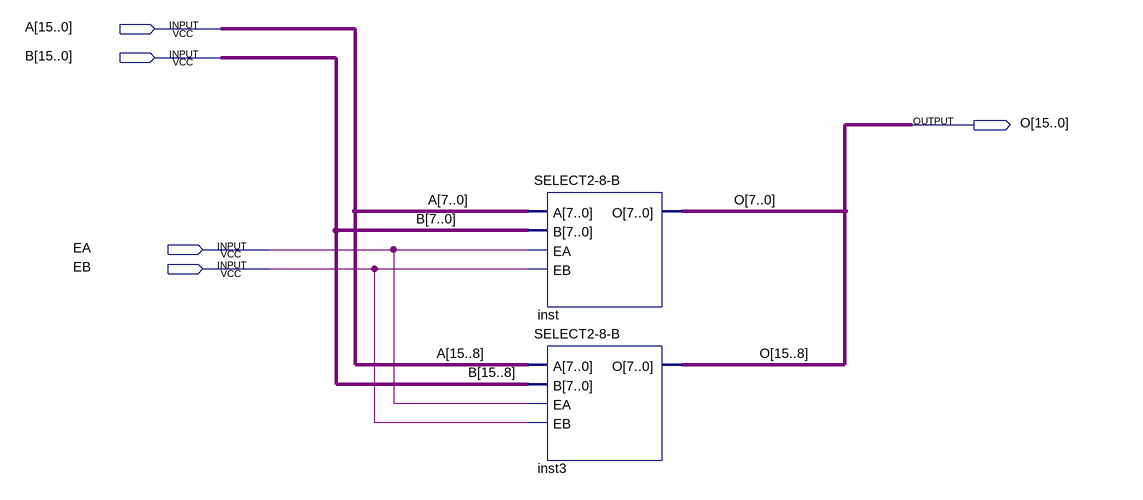
[diagram p0: schematic sheet]
// Quartus schematic SELECT2-16-B.bdf as structural Verilog: 2 symbols, 5 pins
module \SELECT2-16-B  (
  input  [15:0] A,
  input  [15:0] B,
  input  EA,
  input  EB,
  output [15:0] O
);

  \SELECT2-8-B  inst (.A(A[7:0]), .B(B[7:0]), .EA(EA), .EB(EB), .O(O[7:0]));
  \SELECT2-8-B  inst3 (.A(A[15:8]), .B(B[15:8]), .EA(EA), .EB(EB), .O(O[15:8]));
endmodule
